# Altium schematic sheet diban.SchDoc
size A2
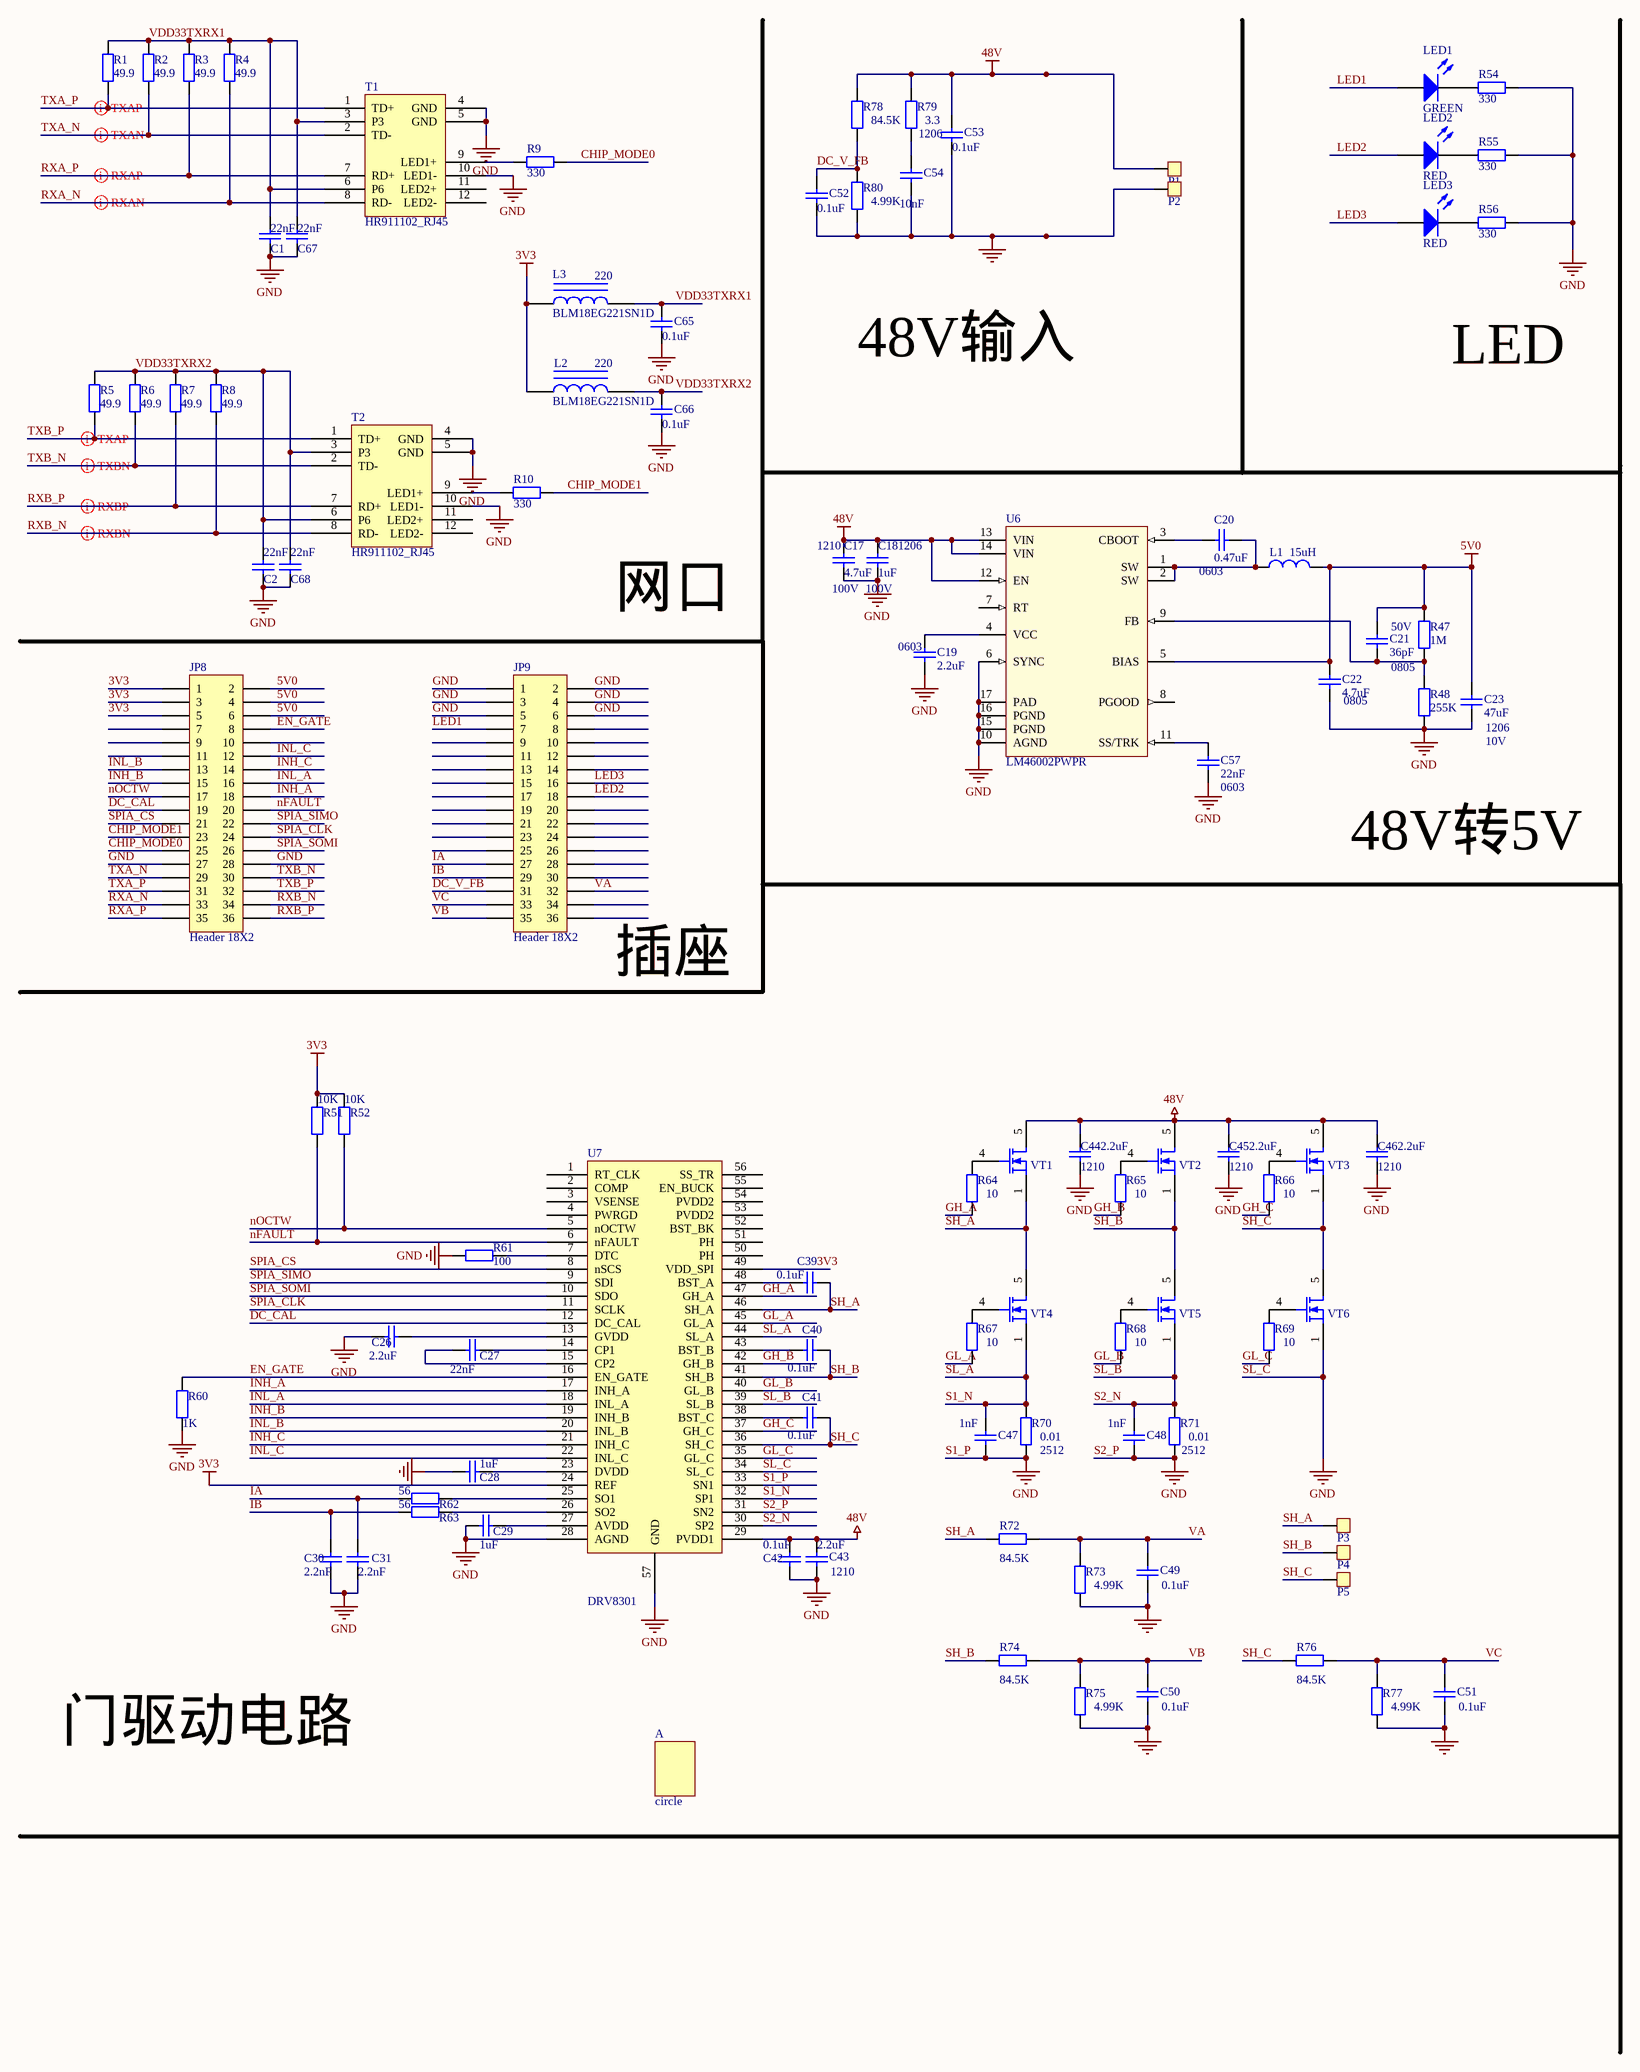
[diagram p0: diban.SchDoc]

## Parts
A  circle  [Circle]
C1  value 22nF  [CC1608-0603]  (hidden comment: 0603B223J6R3NT)
C2  value 22nF  [CC1608-0603]  (hidden comment: 0603B223J6R3NT)
C17  value 4.7uF  Voltage: 100V  Footpoint: 1210  [CC3225-1210]  (hidden comment: C3225X7S2A475M200AB)
C18  value 1uF  Voltage: 100V  Footpoint: 1206  [CC3216-1206]  (hidden comment: C3216X5R2A105K)
C19  value 2.2uF  Footpoint: 0603  [CC1608-0603]  (hidden comment: 0603B225J6R3NT)
C20  value 0.47uF  Footpoint: 0603  [CC1608-0603]  (hidden comment: 0603B474J6R3NT)
C21  value 36pF  Voltage: 50V  Footpoint: 0805  [CC2012-0805]  (hidden comment: CL21C360JBANNNC)
C22  value 4.7uF  Footpoint: 0805  [CC2012-0805]  (hidden comment: GRM21BR61E475KA12L)
C23  value 47uF  Footpoint: 1206  Voltage: 10V  [CC3216-1206]  (hidden comment: GRM31CR61A476KE15L)
C26  value 2.2uF  [CC2012-0805]  (hidden comment: 0603B225J6R3NT)
C27  value 22nF  [CC1608-0603]  (hidden comment: 0603B223J500NT)
C28  value 1uF  [CC1608-0603]  (hidden comment: 0603B105J250NT)
C29  value 1uF  [CC1608-0603]  (hidden comment: 0603B105J250NT)
C30  value 2.2nF  [CC1608-0603]  (hidden comment: 0603B222J6R3NT)
C31  value 2.2nF  [CC1608-0603]  (hidden comment: 0603B222J6R3NT)
C39  value 0.1uF  [CC1608-0603]  (hidden comment: 0603B104J500NT)
C40  value 0.1uF  [CC1608-0603]  (hidden comment: 0603B104J500NT)
C41  value 0.1uF  [CC1608-0603]  (hidden comment: 0603B104J500NT)
C42  value 0.1uF  [CC1608-0603]  (hidden comment: 0603B104J101NT)
C43  value 2.2uF  Footpoint: 1210  [CC3225-1210]  (hidden comment: GRM32ER72A225KA35L)
C44  value 2.2uF  Footpoint: 1210  [CC3225-1210]  (hidden comment: GRM32ER72A225KA35L)
C45  Footpoint: 1210  [CC3225-1210]  (hidden comment: GRM32ER72A225KA35L)
C46  Footpoint: 1210  [CC3225-1210]  (hidden comment: GRM32ER72A225KA35L)
C47  value 1nF  [CC1608-0603]  (hidden comment: 0603B102J500NT)
C48  value 1nF  [CC1608-0603]  (hidden comment: 0603B102J500NT)
C49  value 0.1uF  [CC1608-0603]  (hidden comment: 0603B104J160NT)
C50  value 0.1uF  [CC1608-0603]  (hidden comment: 0603B104J160NT)
C51  value 0.1uF  [CC1608-0603]  (hidden comment: 0603B104J160NT)
C52  value 0.1uF  [CC1608-0603]  (hidden comment: 0603B104J160NT)
C53  value 0.1uF  [CC1608-0603]  (hidden comment: 0603B104J101NT)
C54  value 10nF  [CC1608-0603]  (hidden comment: 0603B103J101NT)
C57  value 22nF  Footpoint: 0603  [CC1608-0603]  (hidden comment: 0603B223J6R3NT)
C65  value 0.1uF  [CC1608-0603]  (hidden comment: 0402B104J6R3NT)
C66  value 0.1uF  [CC1608-0603]  (hidden comment: 0402B104J6R3NT)
C67  value 22nF  [CC1608-0603]  (hidden comment: 0603B223J6R3NT)
C68  value 22nF  [CC1608-0603]  (hidden comment: 0603B223J6R3NT)
JP8  Header 18X2  [DC_1.27_36]
JP9  Header 18X2  [DC_1.27_36]
L1  value 15uH  [SPR6540]  (hidden comment: SPR6540-150M)
L2  BLM18EG221SN1D  value 220  [BLM0603]
L3  BLM18EG221SN1D  value 220  [BLM0603]
LED1  LED Chip  [0603D]  (value not drawn)
LED2  LED Chip  [0603D]  (value not drawn)
LED3  LED Chip  [0603D]  (value not drawn)
P1  PAD  [PAD]  (value not drawn)
P2  PAD  [PAD]  (value not drawn)
P3  PAD  [PAD]  (value not drawn)
P4  PAD  [PAD]  (value not drawn)
P5  PAD  [PAD]  (value not drawn)
R1  value 49.9  [CR1608-0603]  (hidden comment: RC03K49R9JT)
R2  value 49.9  [CR1608-0603]  (hidden comment: RC03K49R9JT)
R3  value 49.9  [CR1608-0603]  (hidden comment: RC03K49R9JT)
R4  value 49.9  [CR1608-0603]  (hidden comment: RC03K49R9JT)
R5  value 49.9  [CR1608-0603]  (hidden comment: RC03K49R9JT)
R6  value 49.9  [CR1608-0603]  (hidden comment: RC03K49R9JT)
R7  value 49.9  [CR1608-0603]  (hidden comment: RC03K49R9JT)
R8  value 49.9  [CR1608-0603]  (hidden comment: RC03K49R9JT)
R9  value 330  [CR1608-0603]  (hidden comment: RC03K331JT)
R10  value 330  [CR1608-0603]  (hidden comment: RC03K331JT)
R47  value 1M  [CR1608-0603]  (hidden comment: RC03K105JT)
R48  value 255K  [CR1608-0603]  (hidden comment: RC03K2553JT)
R51  value 10K  [CR1608-0603]  (hidden comment: RC03K103JT)
R52  value 10K  [CR1608-0603]  (hidden comment: RC03K103JT)
R54  value 330  [CR1608-0603]  (hidden comment: RC03K331JT)
R55  value 330  [CR1608-0603]  (hidden comment: RC03K331JT)
R56  value 330  [CR1608-0603]  (hidden comment: RC03K331JT)
R60  value 1K  [CR1608-0603]  (hidden comment: RC03K102JT)
R61  value 100  [CR1608-0603]  (hidden comment: RC03K101JT)
R62  value 56  [CR1608-0603]  (hidden comment: RC03K560JT)
R63  value 56  [CR1608-0603]  (hidden comment: RC03K560JT)
R64  value 10  [CR1608-0603]  (hidden comment: RC03K100JT)
R65  value 10  [CR1608-0603]  (hidden comment: RC03K100JT)
R66  value 10  [CR1608-0603]  (hidden comment: RC03K100JT)
R67  value 10  [CR1608-0603]  (hidden comment: RC03K100JT)
R68  value 10  [CR1608-0603]  (hidden comment: RC03K100JT)
R69  value 10  [CR1608-0603]  (hidden comment: RC03K100JT)
R70  value 0.01  Footpoint: 2512  [CR6332-2512]  (hidden comment: CRA2512-FZ-R010ELF)
R71  value 0.01  Footpoint: 2512  [CR6332-2512]  (hidden comment: CRA2512-FZ-R010ELF)
R72  value 84.5K  [CR1608-0603]  (hidden comment: RC03K8452JT)
R73  value 4.99K  [CR1608-0603]  (hidden comment: RC03K4991JT)
R74  value 84.5K  [CR1608-0603]  (hidden comment: RC03K8452JT)
R75  value 4.99K  [CR1608-0603]  (hidden comment: RC03K4991JT)
R76  value 84.5K  [CR1608-0603]  (hidden comment: RC03K8452JT)
R77  value 4.99K  [CR1608-0603]  (hidden comment: RC03K4991JT)
R78  value 84.5K  [CR1608-0603]  (hidden comment: RC03K8452JT)
R79  value 3.3  Footpoint: 1206  [CR3216-1206]  (hidden comment: CRCW12063R30JNEA)
R80  value 4.99K  [CR1608-0603]  (hidden comment: RC03K4991JT)
T1  HR911102_RJ45  [RJ45]
T2  HR911102_RJ45  [RJ45]
U6  LM46002PWPR  [IM46002]
U7  DRV8301  [DRV8301]
VT1  CSD18540  [CSD18540 - duplicate]  (value not drawn)
VT2  CSD18540  [CSD18540 - duplicate]  (value not drawn)
VT3  CSD18540  [CSD18540 - duplicate]  (value not drawn)
VT4  CSD18540  [CSD18540 - duplicate]  (value not drawn)
VT5  CSD18540  [CSD18540 - duplicate]  (value not drawn)
VT6  CSD18540  [CSD18540 - duplicate]  (value not drawn)

## Nets
3V3: JP8.1 JP8.3 JP8.5 L2.1 L3.1 R51.2 R52.2 U7.24(REF) U7.49(VDD_SPI)
5V0: C21.2 C22.2 C23.2 JP8.2 JP8.4 JP8.6 L1.2 R47.1 U6.5(BIAS)
48V: C17.1 C18.1 C42.2 C43.2 C44.1 C45.1 C46.1 C53.2 P1.1 R78.2 R79.2 U6.12(EN) U6.13(VIN) U6.14(VIN) U7.29(PVDD1) VT1.5(D) VT2.5(D) VT3.5(D)
GND: C1.1 C2.1 C17.2 C18.2 C19.2 C22.1 C23.1 C26.1 C28.1 C29.1 C30.1 C31.1 C42.1 C43.1 C44.2 C45.2 C46.2 C47.2 C48.2 C49.1 C50.1 C51.1 C52.1 C53.1 C54.1 C57.1 C65.1 C66.1 C67.1 C68.1 JP8.27 JP8.28 JP9.1 JP9.2 JP9.3 JP9.4 JP9.5 JP9.6 P2.1 R48.2 R54.1 R55.1 R56.1 R60.1 R61.1 R70.1 R71.1 R73.1 R75.1 R77.1 R80.1 T1.4(GND) T1.5(GND) T1.10(LED1-) T2.4(GND) T2.5(GND) T2.10(LED1-) U6.6(SYNC) U6.10(AGND) U6.15(PGND) U6.16(PGND) U6.17(PAD) U7.28(AGND) U7.31(SN2) U7.33(SN1) U7.34(SL_C) U7.57(GND) VT6.1(S)  [also labelled S1_P, S2_P, SL_C]
CHIP_MODE0: JP8.25 R9.1
CHIP_MODE1: JP8.23 R10.1
DC_CAL: JP8.19 U7.12(DC_CAL)
DC_V_FB: C52.2 JP9.31 R78.1 R80.2
EN_GATE: JP8.8 R60.2 U7.16(EN_GATE)
GH_A: R64.2 U7.47(GH_A)
GH_B: R65.2 U7.42(GH_B)
GH_C: R66.2 U7.37(GH_C)
GL_A: R67.2 U7.45(GL_A)
GL_B: R68.2 U7.40(GL_B)
GL_C: R69.2 U7.35(GL_C)
IA: C31.2 JP9.27 R62.1
IB: C30.2 JP9.29 R63.1
INH_A: JP8.18 U7.17(INH_A)
INH_B: JP8.15 U7.19(INH_B)
INH_C: JP8.14 U7.21(INH_C)
INL_A: JP8.16 U7.18(INL_A)
INL_B: JP8.13 U7.20(INL_B)
INL_C: JP8.12 U7.22(INL_C)
LED1: JP9.7 LED1.1(A)
LED2: JP9.18 LED2.1(A)
LED3: JP9.16 LED3.1(A)
nFAULT: JP8.20 R51.1 U7.6(nFAULT)
nOCTW: JP8.17 R52.1 U7.5(nOCTW)
RXA_N: JP8.33 R4.1 T1.8(RD-)
RXA_P: JP8.35 R3.1 T1.7(RD+)
RXB_N: JP8.34 R8.1 T2.8(RD-)
RXB_P: JP8.36 R7.1 T2.7(RD+)
S1_N: C47.1 R70.2 U7.32(SP1) U7.44(SL_A) VT4.1(S)  [also labelled SL_A]
S2_N: C48.1 R71.2 U7.30(SP2) U7.39(SL_B) VT5.1(S)  [also labelled SL_B]
SH_A: C39.2 P3.1 R72.1 U7.46(SH_A) VT1.1(S) VT4.5(D)
SH_B: C40.2 P4.1 R74.1 U7.41(SH_B) VT2.1(S) VT5.5(D)
SH_C: C41.2 P5.1 R76.1 U7.36(SH_C) VT3.1(S) VT6.5(D)
SPIA_CLK: JP8.24 U7.11(SCLK)
SPIA_CS: JP8.21 U7.8(nSCS)
SPIA_SIMO: JP8.22 U7.9(SDI)
SPIA_SOMI: JP8.26 U7.10(SDO)
TXA_N: JP8.29 R2.1 T1.2(TD-)
TXA_P: JP8.31 R1.1 T1.1(TD+)
TXB_N: JP8.30 R6.1 T2.2(TD-)
TXB_P: JP8.32 R5.1 T2.1(TD+)
VA: C49.2 JP9.32 R72.2 R73.2
VB: C50.2 JP9.35 R74.2 R75.2
VC: C51.2 JP9.33 R76.2 R77.2
VDD33TXRX1: C1.2 C65.2 C67.2 L3.2 R1.2 R2.2 R3.2 R4.2 T1.3(P3) T1.6(P6)
VDD33TXRX2: C2.2 C66.2 C68.2 L2.2 R5.2 R6.2 R7.2 R8.2 T2.3(P3) T2.6(P6)
NetC19_1: C19.1 U6.4(VCC)
NetC20_1: C20.1 U6.3(CBOOT)
NetC20_2: C20.2 L1.1 U6.1(SW) U6.2(SW)
NetC21_1: C21.1 R47.2 R48.1 U6.9(FB)
NetC26_2: C26.2 U7.13(GVDD)
NetC27_1: C27.1 U7.15(CP2)
NetC27_2: C27.2 U7.14(CP1)
NetC28_2: C28.2 U7.23(DVDD)
NetC29_2: C29.2 U7.27(AVDD)
NetC39_1: C39.1 U7.48(BST_A)
NetC40_1: C40.1 U7.43(BST_B)
NetC41_1: C41.1 U7.38(BST_C)
NetC54_2: C54.2 R79.1
NetC57_2: C57.2 U6.11(SS/TRK)
NetLED1_2: LED1.2(K) R54.2
NetLED2_2: LED2.2(K) R55.2
NetLED3_2: LED3.2(K) R56.2
NetR9_2: R9.2 T1.9(LED1+)
NetR10_2: R10.2 T2.9(LED1+)
NetR61_2: R61.2 U7.7(DTC)
NetR62_2: R62.2 U7.25(SO1)
NetR63_2: R63.2 U7.26(SO2)
NetR64_1: R64.1 VT1.4(G)
NetR65_1: R65.1 VT2.4(G)
NetR66_1: R66.1 VT3.4(G)
NetR67_1: R67.1 VT4.4(G)
NetR68_1: R68.1 VT5.4(G)
NetR69_1: R69.1 VT6.4(G)

Not connected (* = marked no-connect by the designer): JP8 7 9 10 11; JP9 8 9 10 11 12 13 14 15 17 19 20 21 22 23 24 25 26 28 30 34 36; T1 11(LED2+) 12(LED2-); T2 11(LED2+) 12(LED2-); U6 7(RT) 8(PGOOD); U7 1(RT_CLK) 2(COMP) 3(VSENSE) 4(PWRGD) 50(PH) 51(PH) 52(BST_BK) 53(PVDD2) 54(PVDD2) 55(EN_BUCK) 56(SS_TR)

## Layout directives
differential pair: RXA_N, RXA_P, RXB_N, RXB_P, TXA_N, TXA_P, TXB_N, TXB_P

## Notes on the sheet
- 48V输入
- LED
- 网口
- 48V转5V
- (near JP9) 插座
- 门驱动电路
- (in symbol CAP) 2.2uF
- (in symbol LED Chip) GREEN; RED

## Library data of the parts
C1 C2 C17-C23 C26-C31 C39-C54 C57 C65-C68 = CAP
JP8 JP9 = Header 18X2: Header,36-Pin, Dual row; LatestRevisionDate: 17-Jul-2002; LatestRevisionNote: Re-released for DXP Platform.; Publisher: Altium Limited
L1 = Inductor Chip: Inductor; Published: *; Revision: *; Publisher: *
L2 L3 = Inductor Iron: Magnetic-Core Inductor; Published: *; Revision: *; Publisher: *
LED1-LED3 = LED Chip: Typical Chip LED; Published: 8-Jun-2000; Revision: July-2002: Re-released for DXP Platform.; Publisher: Altium Limited
R1-R10 R47 R48 R51 R52 R54-R56 R60-R80 = Resistor
U6 = LM46002PWPR: Imported; Alternate Manufacturer: None; Manufacturer: Texas Instruments; CurrentTime: Not shown in title block; DocumentNumber: 1; SymbolCreator: a0411947; CompType: IC; U/M: EA; Designator: U?; PIN_COUNT: 17; CurrentDate: Not shown in title block; Time: Not shown in title block; Date: Not shown in title block; DocumentFullPathAndName: Not shown in title block; DocumentName: Not shown in title block; ModifiedDate: Not shown in title block; ApprovedBy: Not shown in title block; CheckedBy: Not shown in title block; Author: Not shown in title block; CompanyName: Not shown in title block; Engineer: Not shown in title block; Organization: Not shown in title block; Address1: Not shown in title block; Address2: Not shown in title block; Address3: Not shown in title block; Address4: Not shown in title block; Revision: Use project parameter SCH_Rev; SheetNumber: 1; SheetTotal: 1; ImagePath: Not shown in title block; Rule: *; ProjectName: *; SymbolVersion: 2014-01-28; PartNumber: LM46002PWP; PackageReference: PWP0016A; MountType: SMT; ComponentLink1Description: Datasheet Link; ComponentLink1URL: https://sps06.itg.ti.com/sites/KMS/crossdivteams/altium/docs/ComponentDatasheets/LM46002-PrelimDS-2014-1-16.pdf; RoHS: Y; Publisher: Texas Instruments; LatestRevisionDate: 2014-02-20; RefDes: RefDes; Type: DEV; Value: Value